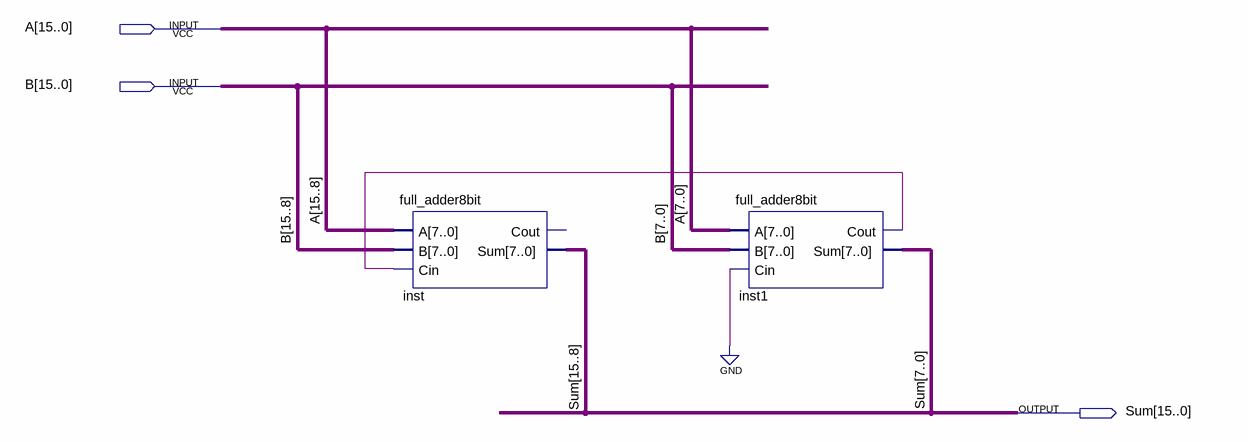
[diagram p0: schematic sheet]
// Quartus schematic full_adder16bit.bdf as structural Verilog: 2 symbols, 3 pins
module full_adder16bit (
  input  [15:0] A,
  input  [15:0] B,
  output [15:0] Sum
);

  wire inst1_cout;

  full_adder8bit inst (.A(A[15:8]), .B(B[15:8]), .Cin(inst1_cout), .Sum(Sum[15:8]));  // open: Cout
  full_adder8bit inst1 (.A(A[7:0]), .B(B[7:0]), .Cin(1'b0), .Cout(inst1_cout), .Sum(Sum[7:0]));
endmodule
